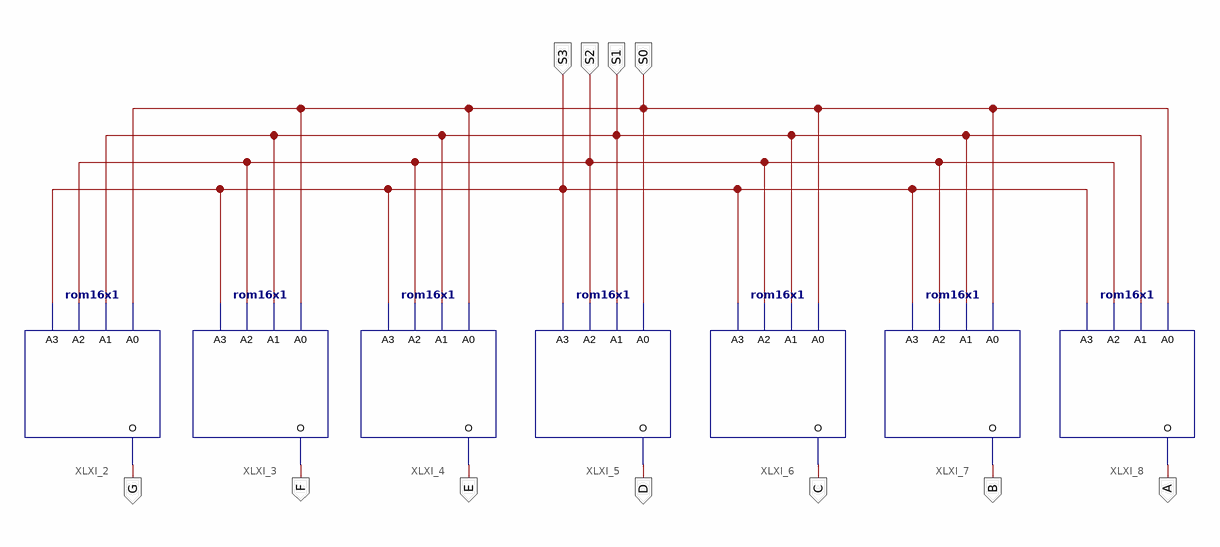
[diagram p0: schematic sheet 1]
// Xilinx ISE schematic LUT.sch (spartan3e) as structural Verilog: 7 symbols, 11 ports
module LUT (
  input  S0,
  input  S1,
  input  S2,
  input  S3,
  output G,
  output F,
  output E,
  output D,
  output C,
  output B,
  output A
);

  rom16x1 #(.INIT("8283")) XLXI_2 (.A0(S0), .A1(S1), .A2(S2), .A3(S3), .O(G));
  rom16x1 #(.INIT("E28E")) XLXI_3 (.A0(S0), .A1(S1), .A2(S2), .A3(S3), .O(F));
  rom16x1 #(.INIT("BABA")) XLXI_4 (.A0(S0), .A1(S1), .A2(S2), .A3(S3), .O(E));
  rom16x1 #(.INIT("9292")) XLXI_5 (.A0(S0), .A1(S1), .A2(S2), .A3(S3), .O(D));
  rom16x1 #(.INIT("4004")) XLXI_6 (.A0(S0), .A1(S1), .A2(S2), .A3(S3), .O(C));
  rom16x1 #(.INIT("0C60")) XLXI_7 (.A0(S0), .A1(S1), .A2(S2), .A3(S3), .O(B));
  rom16x1 #(.INIT("9012")) XLXI_8 (.A0(S0), .A1(S1), .A2(S2), .A3(S3), .O(A));
endmodule
